# Altium schematic sheet driver.SchDoc
size A4
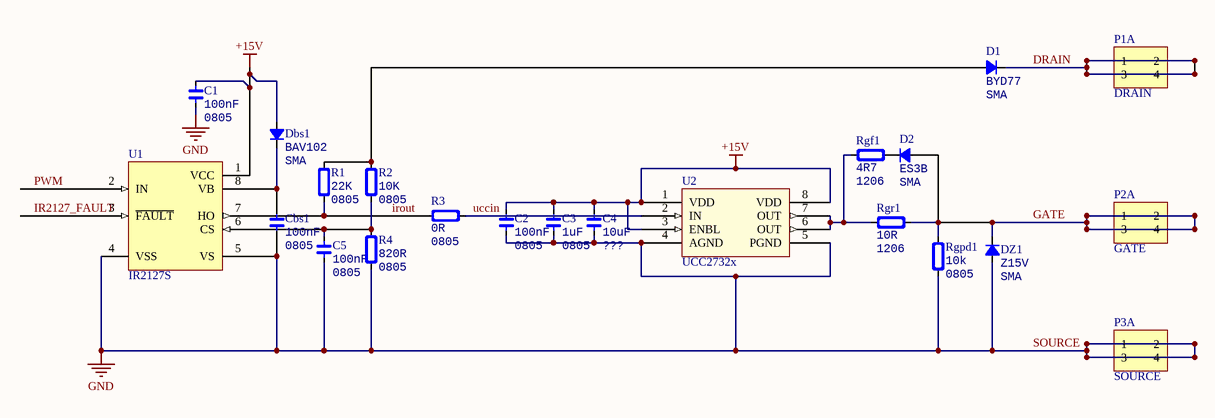
[diagram p0: driver.SchDoc]

## Parts
C1  Type: 0805  [0805C]  (hidden comment: 100nF)
C2  Type: 0805  [0805C]  (hidden comment: 100nF)
C3  Type: 0805  [0805C]  (hidden comment: 1uF)
C4  Type: ???  [0805C]  (hidden comment: 10uF)
C5  Type: 0805  [0805C]  (hidden comment: 100nF)
Cbs1  Type: 0805  [0805C]  (hidden comment: 100nF)
D1  Type: SMA  [DSO-C2/X2.3]  (hidden comment: BYD77)
D2  Type: SMA  [DSO-C2/X2.3]  (hidden comment: ES3B)
Dbs1  Type: SMA  [DSO-C2/X2.3]  (hidden comment: BAV102)
DZ1  Type: SMA  [DSO-C2/X2.3]  (hidden comment: Z15V)
P1A  DRAIN  [HDR2X2]
P2A  GATE  [HDR2X2]
P3A  SOURCE  [HDR2X2]
R1  Type: 0805  [0805R]  (hidden comment: 22K)
R2  Type: 0805  [0805R]  (hidden comment: 10K)
R3  Type: 0805  [0805R]  (hidden comment: 0R)
R4  Type: 0805  [0805R]  (hidden comment: 820R)
Rgf1  Type: 1206  [RESC3225L]  (hidden comment: 4R7)
Rgpd1  Type: 0805  [0805R]  (hidden comment: 10k)
Rgr1  Type: 1206  [RESC3225L]  (hidden comment: 10R)
U1  IR2127S  [SOIC08-150(50)]
U2  UCC2732x  [SOIC08-Thermal]

## Nets
+15V: C1.1 C2.1 C3.1 C4.1 Dbs1.1(A) U1.1(VCC) U2.1(VDD) U2.3(ENBL) U2.8(VDD)
SOURCE: C1.2 C2.2 C3.2 C4.2 C5.2 Cbs1.2 DZ1.1(A) P3A.1 P3A.2 P3A.3 P3A.4 R4.2 Rgpd1.2 U1.4(VSS) U1.5(VS) U2.4(AGND) U2.5(PGND)  [also labelled GND]
DRAIN: D1.2(K) P1A.1 P1A.2 P1A.3 P1A.4
GATE: D2.1(A) DZ1.2(K) P2A.1 P2A.2 P2A.3 P2A.4 Rgpd1.1 Rgr1.1
IR2127_FAULT: U1.3(~{FAULT})
irout: R1.2 R3.2 U1.7(HO)
PWM: U1.2(IN)
uccin: R3.1 U2.2(IN)
NetC5_1: C5.1 R2.2 R4.1 U1.6(CS)
NetCbs1_1: Cbs1.1 Dbs1.2(K) U1.8(VB)
NetD1_1: D1.1(A) R1.1 R2.1
NetD2_2: D2.2(K) Rgf1.1
NetRgf1_2: Rgf1.2 Rgr1.2 U2.6(OUT) U2.7(OUT)

## Library data of the parts
C1-C5 Cbs1 = Cap_0805: Capacitor
  C1 C2 C5 Cbs1: Value: 100nF
  C3: Value: 1uF
  C4: Value: 10uF
D1 D2 Dbs1 DZ1 = Diode_SMA: Diode
  D1: Value: BYD77
  D2: Value: ES3B
  Dbs1: Value: BAV102
  DZ1: Value: Z15V
P1A P2A P3A = Header 2X2: Header, 2-Pin, Dual row; LatestRevisionDate: 17-Jul-2002; LatestRevisionNote: Re-released for DXP Platform.; Publisher: Altium Limited
R1-R4 Rgf1 Rgpd1 Rgr1 = Res_0805: Resistor
  R1: Value: 22K
  R2: Value: 10K
  R3: Value: 0R
  R4: Value: 820R
  Rgf1: Value: 4R7
  Rgpd1: Value: 10k
  Rgr1: Value: 10R
U1 = IR2127S: Current Sensing Single Channel Driver; Published: 8-Jun-2000; LatestRevisionDate: 13-Apr-2006; LatestRevisionNote: IPC-7351 Footprint Added.; DatasheetVersion: PD60143J; PackageVersion: Feb-2001; PackageReference: SO-8; Publisher: Altium Limited; PackageDescription: 8-Pin Plastic Small Outline Integrated Circuit 1.27 mm Pitch; Code_JEDEC: MS-012-AA; Code_IPC: SOIC127P600-8; ComponentLink1Description: Manufacturer Link; ComponentLink1URL: http://www.irf.com/; ComponentLink2Description: Datasheet; ComponentLink2URL: http://www.irf.com/product-info/datasheets/data/ir2127.pdf; value: IR2127S